# EAGLE schematic matchbox_ble_v01 (EAGLE 7.4.0)
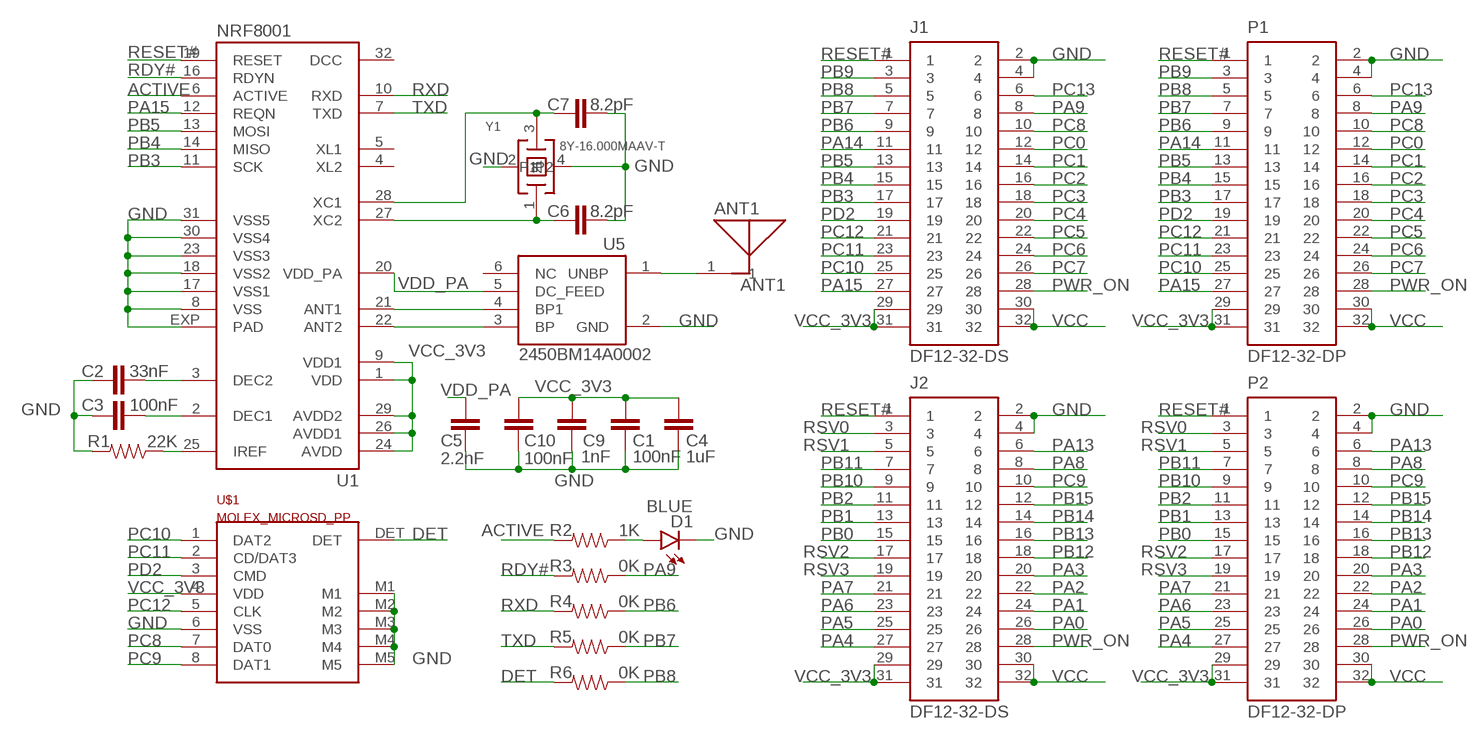
[diagram p0: schematic, sheet 1]

## Parts
ANT1  ANT1  AS-ITM-00132  [2450AT18A100]
C1  100nF  CAP0402-CAP  [0402-CAP]
C2  33nF  CAP0402-CAP  [0402-CAP]
C3  100nF  CAP0402-CAP  [0402-CAP]
C4  1uF  CAP0805  [0805]
C5  2.2nF  CAP0402-CAP  [0402-CAP]
C6  8.2pF  CAP0402-CAP  [0402-CAP]
C7  8.2pF  CAP0402-CAP  [0402-CAP]
C9  1nF  CAP0402-CAP  [0402-CAP]
C10  100nF  CAP0402-CAP  [0402-CAP]
D1  BLUE  LED0603  [LED-0603]
J1  DF12-32-DS  AS-ITM-00012  [DF12-32-DS]
J2  DF12-32-DS  AS-ITM-00012  [DF12-32-DS]
P1  DF12-32-DP  AS-ITM-00015  [DF12-32-DP]
P2  DF12-32-DP  AS-ITM-00015  [DF12-32-DP]
R1  22K  RESISTOR0402-RES  [0402-RES]
R2  1K  RESISTOR0805-RES  [0805]
R3  0K  RESISTOR0805-RES  [0805]
R4  0K  RESISTOR0805-RES  [0805]
R5  0K  RESISTOR0805-RES  [0805]
R6  0K  RESISTOR0805-RES  [0805]
U1  NRF8001  [ATMEL_QFN32]
U5  2450BM14A0002  AS-ITM-00114  [2450BM14A0002]
U$1  MOLEX_MICROSD_PP  [MOLEX_MICROSD_PP]
Y1  8Y-16.000MAAV-T  AS-ITM-00228  [ABM11]

## Nets
ACTIVE: R2.2 U1.6(ACTIVE)
ANT1: U1.21(ANT1) U5.4(BP1)
ANT2: U1.22(ANT2) U5.3(BP)
DET: R6.2 U$1.DET
GND: C1.2 C2.2 C3.2 C4.2 C5.2 C6.2 C7.2 C9.2 C10.2 D1.C J1.2 J1.4 J2.2 J2.4 P1.2 P1.4 P2.2 P2.4 R1.2 U1.8(VSS) U1.17(VSS1) U1.18(VSS2) U1.23(VSS3) U1.30(VSS4) U1.31(VSS5) U1.EXP(PAD) U5.2(GND) U$1.6(VSS) U$1.M1 U$1.M2 U$1.M3 U$1.M4 U$1.M5 Y1.2 Y1.4(P1)
N$1: R1.1 U1.25(IREF)
N$2: C6.1 U1.27(XC2) Y1.1
N$4: C3.1 U1.2(DEC1)
N$5: C2.1 U1.3(DEC2)
N$8: ANT1.1 U5.1(UNBP)
N$9: C7.1 U1.28(XC1) Y1.3
N$10: D1.A R2.1
PA0: J2.26 P2.26
PA1: J2.24 P2.24
PA2: J2.22 P2.22
PA3: J2.20 P2.20
PA4: J2.27 P2.27
PA5: J2.25 P2.25
PA6: J2.23 P2.23
PA7: J2.21 P2.21
PA8: J2.8 P2.8
PA9: J1.8 P1.8 R3.1
PA13: J2.6 P2.6
PA14: J1.11 P1.11
PA15: J1.27 P1.27 U1.12(REQN)
PB0: J2.15 P2.15
PB1: J2.13 P2.13
PB2: J2.11 P2.11
PB3: J1.17 P1.17 U1.11(SCK)
PB4: J1.15 P1.15 U1.14(MISO)
PB5: J1.13 P1.13 U1.13(MOSI)
PB6: J1.9 P1.9 R4.1
PB7: J1.7 P1.7 R5.1
PB8: J1.5 P1.5 R6.1
PB9: J1.3 P1.3
PB10: J2.9 P2.9
PB11: J2.7 P2.7
PB12: J2.18 P2.18
PB13: J2.16 P2.16
PB14: J2.14 P2.14
PB15: J2.12 P2.12
PC0: J1.12 P1.12
PC1: J1.14 P1.14
PC2: J1.16 P1.16
PC3: J1.18 P1.18
PC4: J1.20 P1.20
PC5: J1.22 P1.22
PC6: J1.24 P1.24
PC7: J1.26 P1.26
PC8: J1.10 P1.10 U$1.7(DAT0)
PC9: J2.10 P2.10 U$1.8(DAT1)
PC10: J1.25 P1.25 U$1.1(DAT2)
PC11: J1.23 P1.23 U$1.2(CD/DAT3)
PC12: J1.21 P1.21 U$1.5(CLK)
PC13: J1.6 P1.6
PD2: J1.19 P1.19 U$1.3(CMD)
PWR_ON: J1.28 J2.28 P1.28 P2.28
RDY#: R3.2 U1.16(RDYN)
RESET#: J1.1 J2.1 P1.1 P2.1 U1.19(RESET)
RSV0: J2.3 P2.3
RSV1: J2.5 P2.5
RSV2: J2.17 P2.17
RSV3: J2.19 P2.19
RXD: R4.2 U1.10(RXD)
TXD: R5.2 U1.7(TXD)
VCC: J1.30 J1.32 J2.30 J2.32 P1.30 P1.32 P2.30 P2.32
VCC_3V3: C1.1 C4.1 C9.1 C10.1 J1.29 J1.31 J2.29 J2.31 P1.29 P1.31 P2.29 P2.31 U1.1(VDD) U1.9(VDD1) U1.24(AVDD) U1.26(AVDD1) U1.29(AVDD2) U$1.4(VDD)
VDD_PA: C5.1 U1.20(VDD_PA) U5.5(DC_FEED)
Unconnected: ANT1.2 U1.4(XL2) U1.5(XL1) U1.32(DCC) U5.6(NC)

## Library data of the parts
ANT1 = tinycircuits:AS-ITM-00132: ANTENNA CHIP 2.4GHZ; OC_NEWARK: unknown; PARTNO: AS-ITM-00132; VALUE: 2450AT18A100
C1 C3 C10 = SparkFun-Passives:CAP: Capacitor Standard 0603 ceramic capacitor, and 0.1" leaded capacitor.; MF: VISHAY/SPRAGUE; MPN: 1C20Z5U104M050B; OC_NEWARK: 17F2165
C2 C4-C7 C9 = SparkFun-Passives:CAP: Capacitor Standard 0603 ceramic capacitor, and 0.1" leaded capacitor.; OC_NEWARK: unknown
D1 = SparkFun-LED:LED: LEDs Standard schematic elements and footprints for 5mm, 3mm, 1206, and 0603 sized LEDs. 5mm - Spark Fun Electronics SKU : COM-00529 (and others); OC_NEWARK: unknown
J1 J2 = micro1292:AS-ITM-00012: CONN RECEPT 32POS 3MM SMD 0.5MM; OC_NEWARK: unknown; PARTNO: AS-ITM-00012
P1 P2 = micro1292:AS-ITM-00015: CONN HEADER 32POS 3MM SMD 0.5MM; OC_NEWARK: unknown; PARTNO: AS-ITM-00015
R1-R6 = SparkFun-Passives:RESISTOR: Resistor Basic schematic elements and footprints for 0603, 1206, and PTH resistors.; OC_NEWARK: unknown
U1 = rf_ble:NRF8001: RF System on a Chip - SoC BLUETOOTH LW ENERGY SLAVE CONNCTIVTY-CHP; OC_NEWARK: unknown
U5 = tinycircuits:AS-ITM-00114: 2.45 GHz Impredance Matched Balun-Filter; OC_NEWARK: unknown; PARTNO: AS-ITM-00114
U$1 = molexmicrosd:MOLEX_MICROSD_PP: Molex Push/Push MicroSD Socket Manufacturer Part Number: 5025700893 Digikey: WM19093CT-ND; OC_NEWARK: unknown
Y1 = micro1292:AS-ITM-00228: CRYSTAL 16MHZ 8PF SMD; OC_NEWARK: unknown; PARTNO: AS-ITM-00228